# Altium schematic sheet LDO.SchDoc
size A
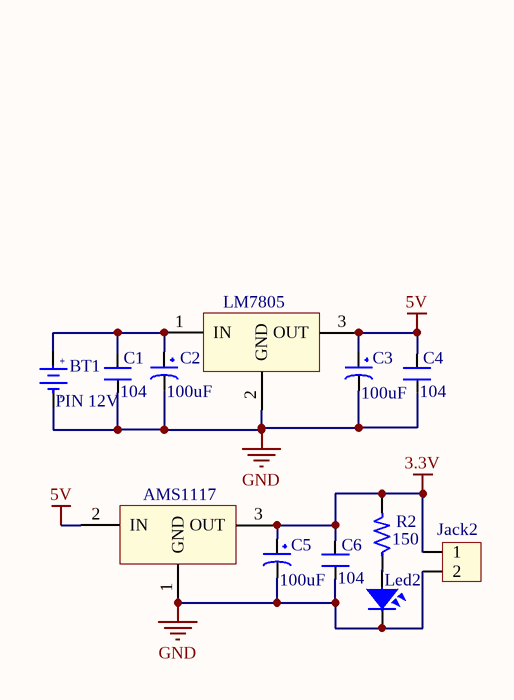
[diagram p0: LDO.SchDoc]

## Parts
(Parts that share a designator on the sheet are numbered #1, #2 ... from top to bottom, then left to right.)
?#1  LM7805  [QTO-220]
?#2  AMS1117  [QTO-220]
BT1  PIN 12V  [PIN3V]
C1  104  [CN2]
C2  100uF  [CP1.5/3.4]
C3  100uF  [CP1.5/3.4]
C4  104  [CN2]
C5  100uF  [CP1.5/3.4]
C6  104  [CN2]
Jack2  (no value)  [CON2]
Led2  LED SMD  [SM-LED-0805-Blue]  (value not drawn)
R2  150  [SM-RES-1206]

## Nets
3.3V: ?#2.3(OUT) C5.1 C6.2 Jack2.1 R2.2
5V: ?#1.3(OUT) ?#2.2(IN) C3.1 C4.2
GND: ?#1.2(GND) ?#2.1(GND) BT1.2(GND) C1.1 C2.2 C3.2 C4.1 C5.2 C6.1 Jack2.2 Led2.2
Net?#1_1: ?#1.1(IN) BT1.1(+3V) C1.2 C2.1
NetLed2_1: Led2.1 R2.1

## Notes on the sheet
- (in symbol PIN 3V) +; -

## Library data of the parts
?#1 = LM78xx: On ap +, from + 5 to + 24VDC; Value: LM7805
?#2 = LM79xx: On ap -, from - 5 to - 24VDC; Value: LM7905
BT1 = PIN 3V: Battery 3VDC; Value: PIN 3V
C1 C4 C6 = CN2: Cap np 104 => 105pF; Value: 0.1uF
C2 C3 C5 = CP3: Cap 100uF/35V - 470uF/16V; Value: 100uF/35V/50V; Description 1: 1000uF/6,3V - 470uF/16V - 330uF - 25V; Description 2: 220uF/35V - 100uF/50V - 63V - 4,7uF/200V; Description 3: 22uF => 33uF100V - 3,3uF => 4,7uF/250V; Description 4: 2,2uF =>3,3uF/350 - 2,2uF/400V - 1uF/450V
Jack2 = Con2: Connector 2; Value: Connector 2
Led2 = LED-SMD-0805
R2 = R: Resistor 1/4W; Value: R1/4W - 1K